# EAGLE design powerblade_4v0 (EAGLE 6.3)

## Sheet 1 of 6: AC-DC Power Supply
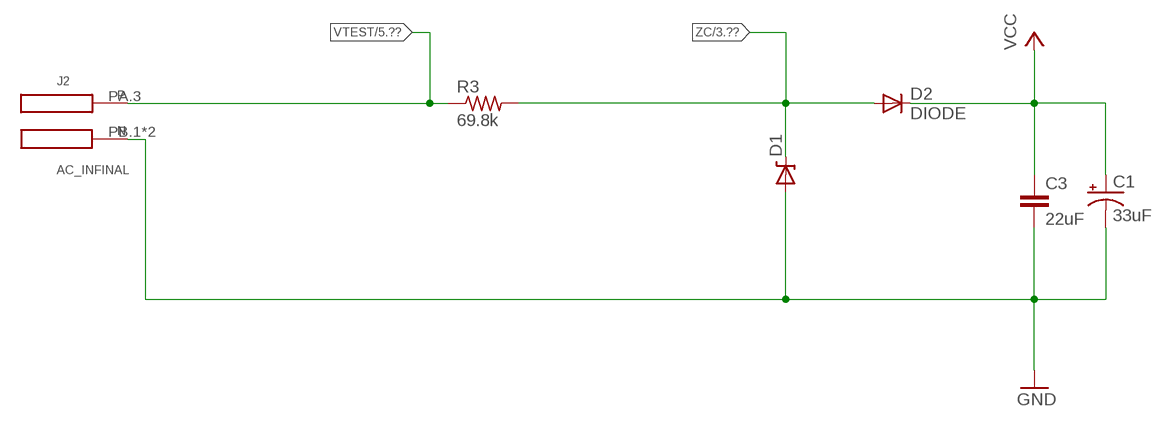
[diagram p0: schematic, sheet 1]

### Parts
C1  33uF  CPOL-US0805_SM  [CPOL0805_SM]
C3  22uF  C-EUC0603_SM  [C0603_SM]
D1  ZENERBZT52  [BZT52]
D2  DIODE  [BAS521]
J2  AC_INFINAL  [AC3_FINAL]
R3  69.8k  R-US_R1210  [R1210]

### Nets
GND: C1.- C3.2 D1.A J2.PB.1(N) J2.PB.3(N) ; also sheet 2,3,4,5,6
VCC: C1.+ C3.1 D2.C ; also sheet 2,3,6
VTEST: J2.PA.3(P) R3.1 ; also sheet 5
ZC: D1.C D2.A R3.2 ; also sheet 3,6

## Sheet 2 of 6: Load Supply Regulation
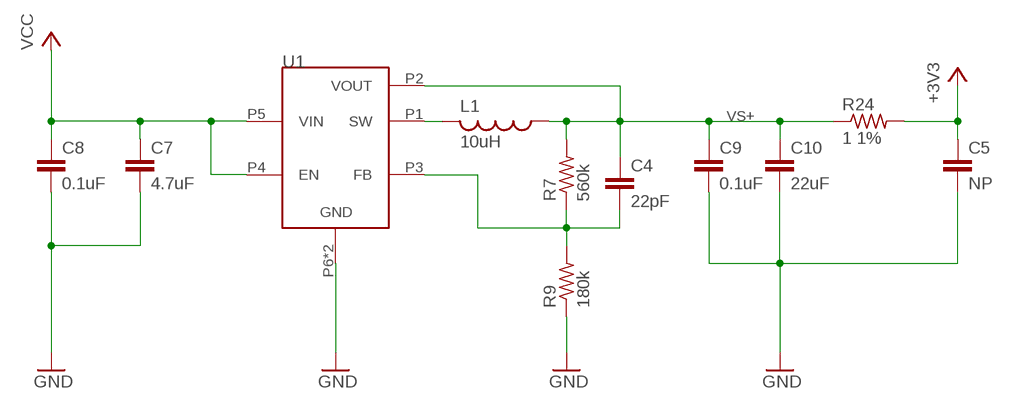
[diagram p1: schematic, sheet 2]

### Parts
C4  22pF  C-EUC0402  [C0402]
C5  NP  C-EUC0603_TN  [C0603_TN]
C7  4.7uF  C-EUC0402  [C0402]
C8  0.1uF  C-EUC0402  [C0402]
C9  0.1uF  C-EUC0402_SM  [C0402_SM]
C10  22uF  C-EUC0603_SM  [C0603_SM]
L1  10uH  L-USL0805  [L0805]
R7  560k  R-US_R0402  [R0402]
R9  180k  R-US_R0402  [R0402]
R24  1 1%  R-US_R0603_SM  [R0603_SM]
U1  TPS62122  [WDFN-6]

### Nets
+3V3: C5.1 R24.2 ; also sheet 3,4,5,6
GND: C5.2 C7.2 C8.2 C9.2 C10.2 R9.1 U1.P6(GND) U1.PAD(GND) ; also sheet 1,3,4,5,6
N$9: L1.2 U1.P1(SW)
N$13: C4.2 R7.1 R9.2 U1.P3(FB)
VCC: C7.1 C8.1 U1.P4(EN) U1.P5(VIN) ; also sheet 1,3,6
VS+: C4.1 C9.1 C10.1 L1.1 R7.2 R24.1 U1.P2(VOUT) ; also sheet 6

## Sheet 3 of 6: MSP430FR5738
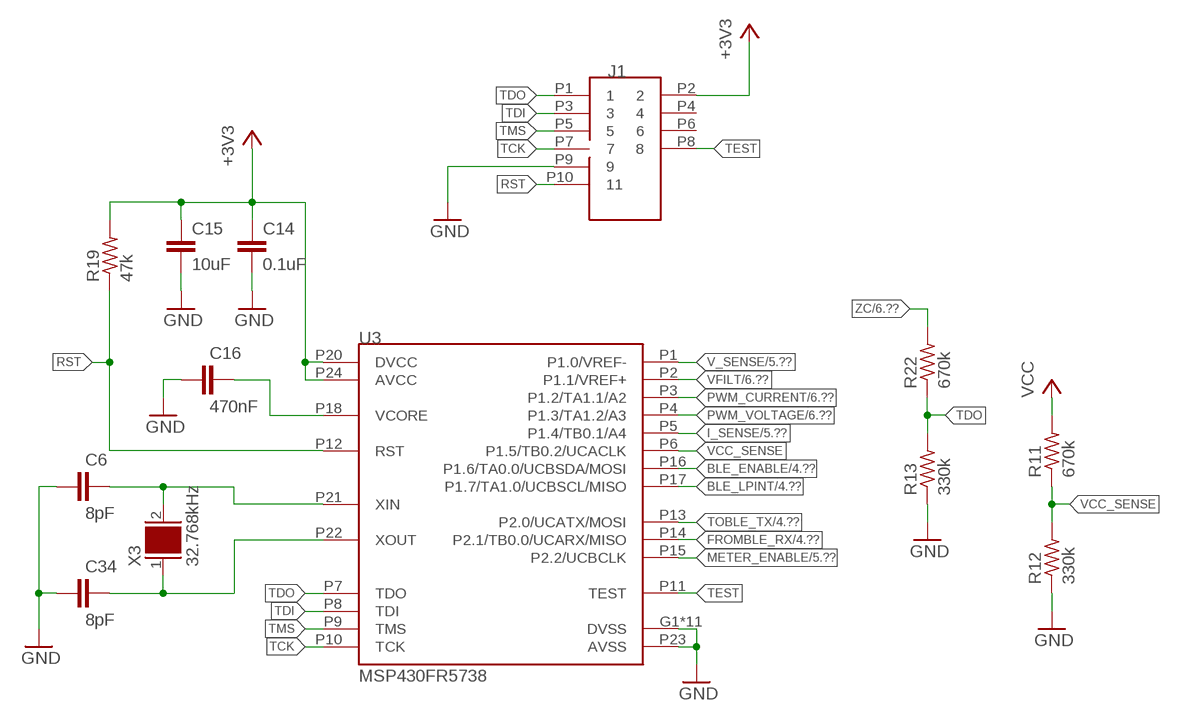
[diagram p2: schematic, sheet 3]

### Parts
C6  8pF  C-EUC0402  [C0402]
C14  0.1uF  C-EUC0402  [C0402]
C15  10uF  C-EUC0603_SM  [C0603_SM]
C16  470nF  C-EUC0402  [C0402]
C34  8pF  C-EUC0402  [C0402]
J1  JTAG_14PIN_IDC-ND  [TC2050-IDC-NL-430-ND]
R11  670k  R-US_R0402  [R0402]
R12  330k  R-US_R0402  [R0402]
R13  330k  R-US_R0402  [R0402]
R19  47k  R-US_R0402  [R0402]
R22  670k  R-US_R0402  [R0402]
U3  MSP430FR5738  [VQFN-24]
X3  32.768kHz  CRYSTAL_0805  [0805]

### Nets
+3V3: C14.1 C15.1 J1.P2 R19.2 U3.P20(DVCC) U3.P24(AVCC) ; also sheet 2,4,5,6
BLE_ENABLE: U3.P16(P1.6/TA0.0/UCBSDA/MOSI) ; also sheet 4
BLE_LPINT: U3.P17(P1.7/TA1.0/UCBSCL/MISO) ; also sheet 4
FROMBLE_RX: U3.P14(P2.1/TB0.0/UCARX/MISO) ; also sheet 4,6
GND: C6.1 C14.2 C15.2 C16.1 C34.1 J1.P9 R12.1 R13.1 U3.G1(DVSS) U3.G2(DVSS) U3.G3(DVSS) U3.G4(DVSS) U3.G5(DVSS) U3.G6(DVSS) U3.G7(DVSS) U3.G8(DVSS) U3.G9(DVSS) U3.P19(DVSS) U3.P23(AVSS) U3.PAD(DVSS) ; also sheet 1,2,4,5,6
I_SENSE: U3.P5(P1.4/TB0.1/A4) ; also sheet 5,6
METER_ENABLE: U3.P15(P2.2/UCBCLK) ; also sheet 5
N$3: C34.2 U3.P22(XOUT) X3.1
N$23: C16.2 U3.P18(VCORE)
N$56: C6.2 U3.P21(XIN) X3.2
PWM_CURRENT: U3.P3(P1.2/TA1.1/A2) ; also sheet 6
PWM_VOLTAGE: U3.P4(P1.3/TA1.2/A3) ; also sheet 6
RST: J1.P10 R19.1 U3.P12(RST)
TCK: J1.P7 U3.P10(TCK)
TDI: J1.P3 U3.P8(TDI)
TDO: J1.P1 R13.2 R22.1 U3.P7(TDO)
TEST: J1.P8 U3.P11(TEST)
TMS: J1.P5 U3.P9(TMS)
TOBLE_TX: U3.P13(P2.0/UCATX/MOSI) ; also sheet 4,6
V_SENSE: U3.P1(P1.0/VREF-) ; also sheet 5,6
VCC: R11.2 ; also sheet 1,2,6
VCC_SENSE: R11.1 R12.2 U3.P6(P1.5/TB0.2/UCACLK)
VFILT: U3.P2(P1.1/VREF+) ; also sheet 5,6
ZC: R22.2 ; also sheet 1,6
Unconnected: J1.P4 J1.P6

## Sheet 4 of 6: nr51822
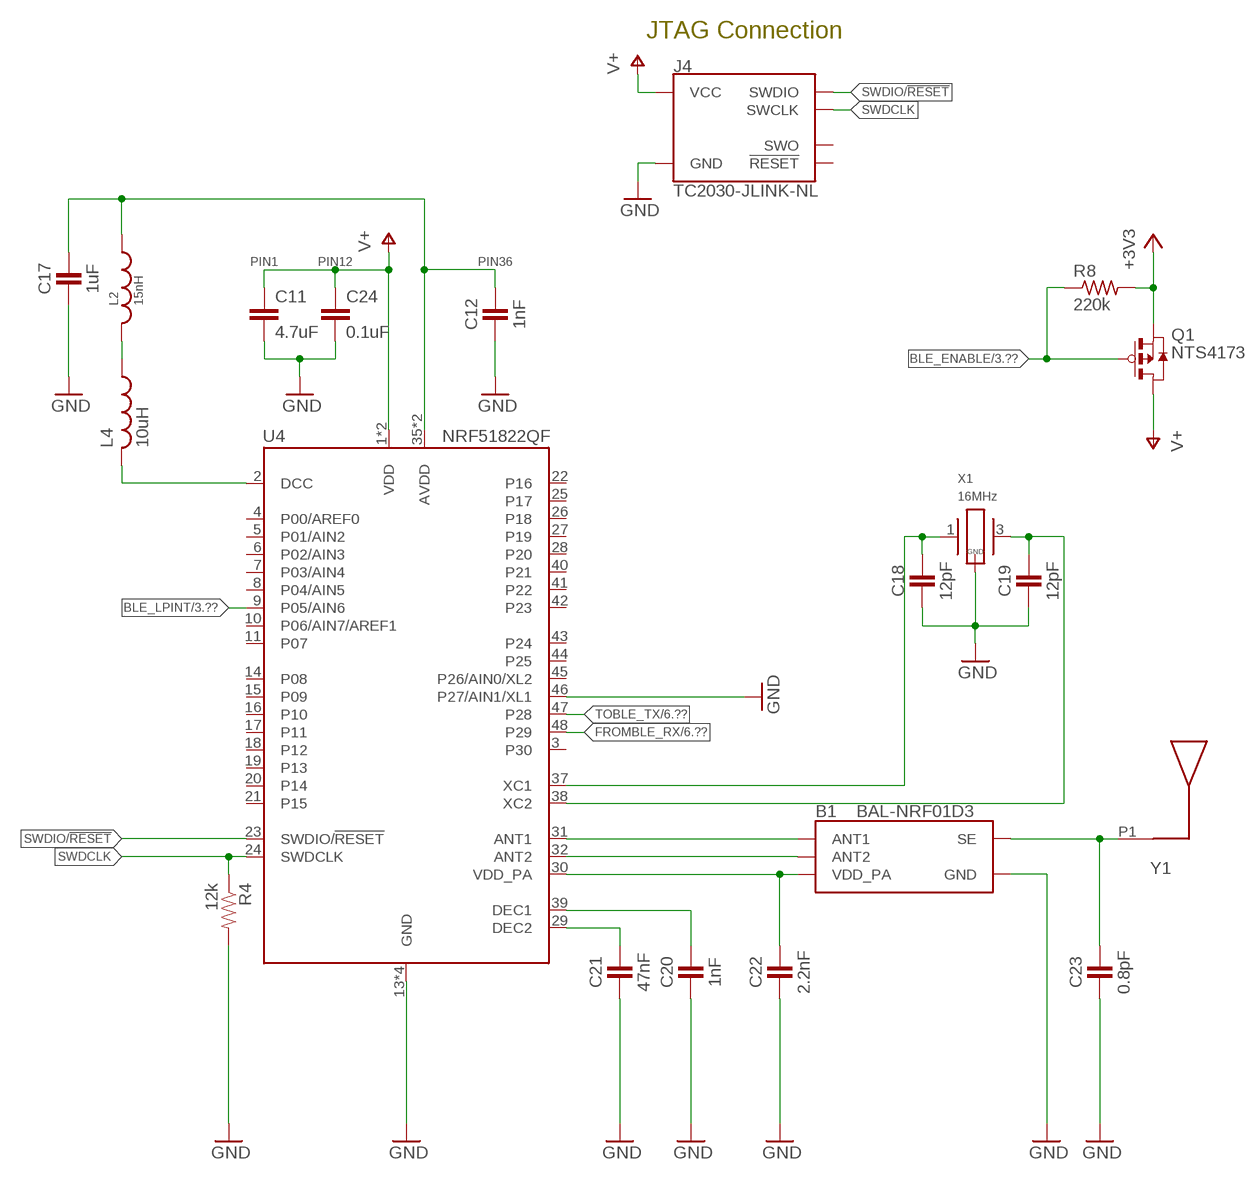
[diagram p3: schematic, sheet 4]

### Parts
B1  BAL-NRF01D3  [BAL-NRF01D3]
C11  4.7uF  C-EUC0402  [C0402]
C12  1nF  CAPACITOR  [0402_CAP]
C17  1uF  CAPACITOR  [0402_CAP]
C18  12pF  CAPACITOR  [0402_CAP]
C19  12pF  CAPACITOR  [0402_CAP]
C20  1nF  CAPACITOR  [0402_CAP]
C21  47nF  CAPACITOR  [0402_CAP]
C22  2.2nF  CAPACITOR  [0402_CAP]
C23  0.8pF  CAPACITOR  [0402_CAP]
C24  0.1uF  C-EUC0402  [C0402]
J4  TC2030-JLINK-NL  [TC2030-IDC-NL]
L2  15nH  INDUCTOR0402  [0402_CAP]
L4  10uH  L-USL0603_TN  [C0603_TN]
Q1  NTS4173  [SC-70-3]
R4  12k  RESISTOR  [0402_RES]
R8  220k  R-US_R0402_SM  [R0402_SM]
U4  NRF51822QF  [QFN-48-6MM]
X1  16MHz  TXC-8Y  [TXC-8Y]
Y1  UREACH_XTEND  [UREACH_XTEND]

### Nets
+3V3: Q1.P2(S) R8.2 ; also sheet 2,3,5,6
AVDD: C12.1 C17.1 L2.1 U4.35(AVDD) U4.36(AVDD)
BLE_ENABLE: Q1.P1(G) R8.1 ; also sheet 3
BLE_LPINT: U4.9(P05/AIN6) ; also sheet 3
DCC: L4.2 U4.2(DCC)
FROMBLE_RX: U4.48(P29) ; also sheet 3,6
GND: B1.GND C11.2 C12.2 C17.2 C18.2 C19.2 C20.2 C21.2 C22.2 C23.2 C24.2 J4.5(GND) R4.2 U4.13(GND) U4.33(GND) U4.34(GND) U4.46(P27/AIN1/XL1) U4.GND X1.2(GND) X1.4(GND) ; also sheet 1,2,3,5,6
N$4: B1.SE C23.1 Y1.P1
N$5: B1.ANT1 U4.31(ANT1)
N$6: B1.ANT2 U4.32(ANT2)
N$10: L2.2 L4.1
N$16: C18.1 U4.37(XC1) X1.1
N$17: C19.1 U4.38(XC2) X1.3
N$18: C20.1 U4.39(DEC1)
N$19: C21.1 U4.29(DEC2)
SWDCLK: J4.4(SWCLK) R4.1 U4.24(SWDCLK)
SWDIO/!RESET: J4.2(SWDIO) U4.23(SWDIO/!RESET)
TOBLE_TX: U4.47(P28) ; also sheet 3,6
V+: C11.1 C24.1 J4.1(VCC) Q1.P3(D) U4.1(VDD) U4.12(VDD)
VDD_PA: B1.VCC(VDD_PA) C22.1 U4.30(VDD_PA)
Unconnected: J4.3(!RESET) J4.6(SWO) U4.3(P30) U4.4(P00/AREF0) U4.5(P01/AIN2) U4.6(P02/AIN3) U4.7(P03/AIN4) U4.8(P04/AIN5) U4.10(P06/AIN7/AREF1) U4.11(P07) U4.14(P08) U4.15(P09) U4.16(P10) U4.17(P11) U4.18(P12) U4.19(P13) U4.20(P14) U4.21(P15) U4.22(P16) U4.25(P17) U4.26(P18) U4.27(P19) U4.28(P20) U4.40(P21) U4.41(P22) U4.42(P23) U4.43(P24) U4.44(P25) U4.45(P26/AIN0/XL2)

### Notes on the sheet
- JTAG Connection
- PIN1 | PIN12 | PIN36

## Sheet 5 of 6: Power Sensing!
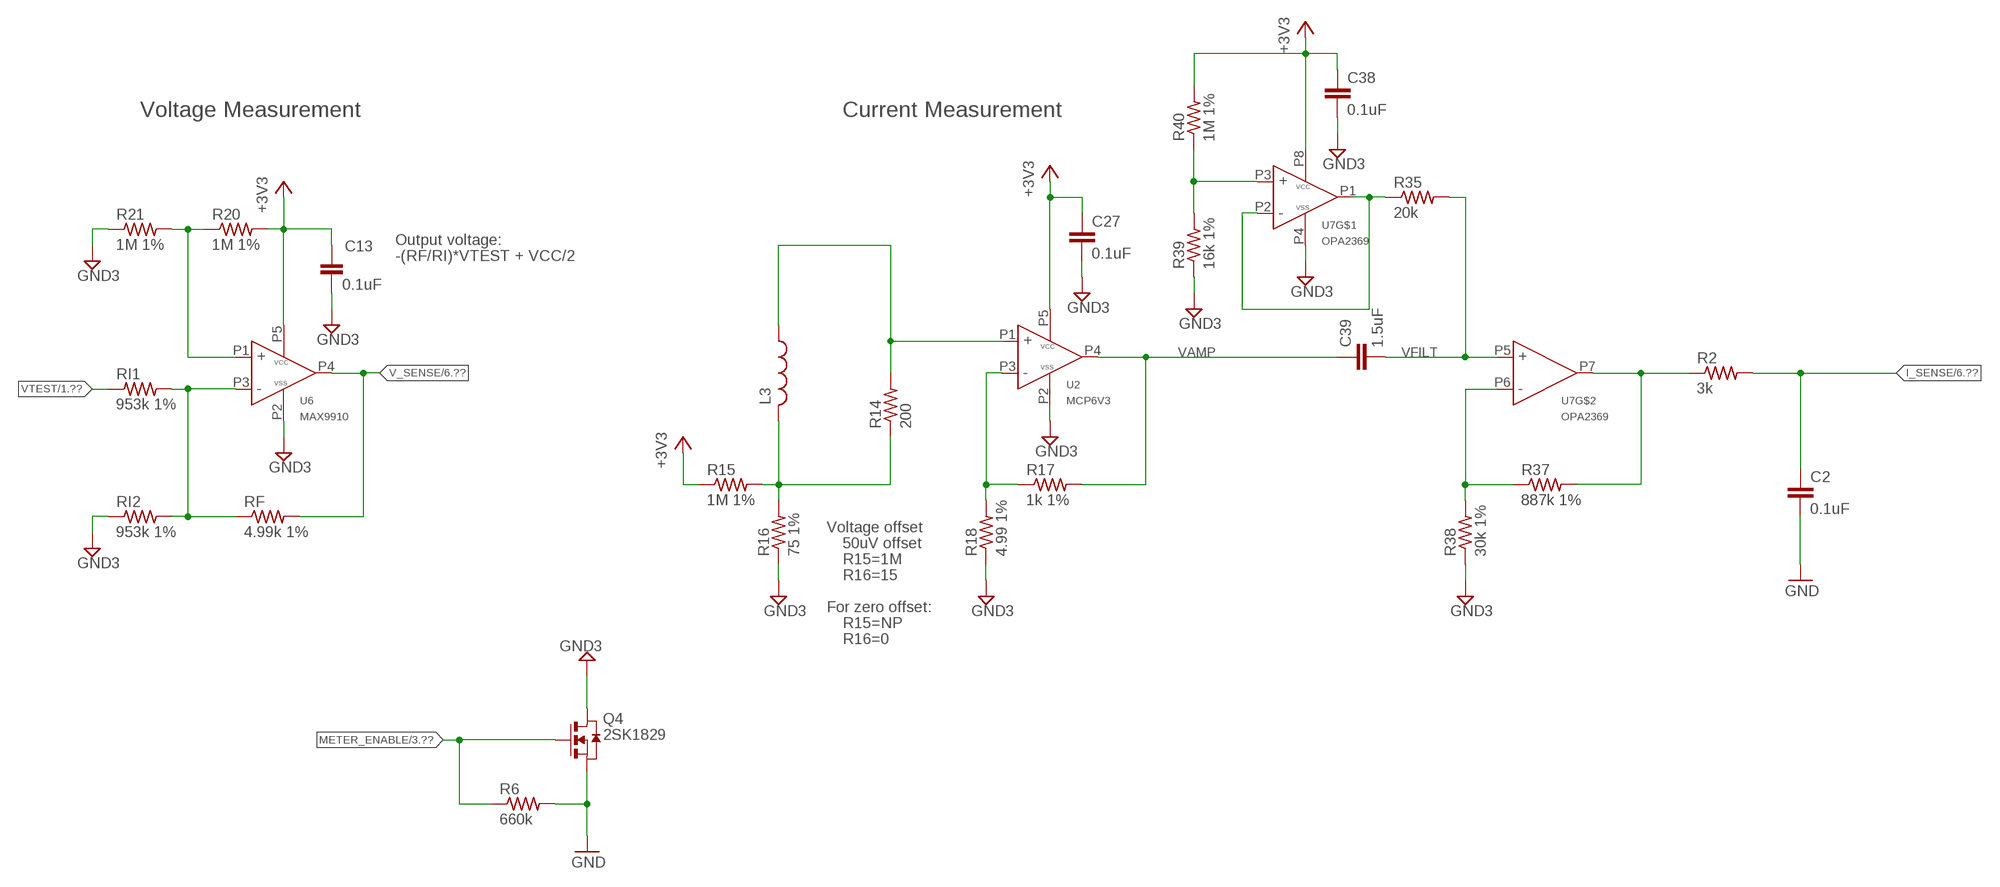
[diagram p4: schematic, sheet 5]

### Parts
C2  0.1uF  C-EUC0402  [C0402]
C13  0.1uF  CAPACITOR  [0402_CAP]
C27  0.1uF  C-EUC0402  [C0402]
C38  0.1uF  C-EUC0402  [C0402]
C39  1.5uF  C-EUC0402  [C0402]
L3  L-USL0805  [L0805]
Q4  2SK1829  [SC-70-3]
R2  3k  R-US_R0402_SM  [R0402_SM]
R6  660k  R-US_R0402  [R0402]
R14  200  R-US_R0402  [R0402]
R15  1M 1%  R-US_R0402  [R0402]
R16  75 1%  R-US_R0402  [R0402]
R17  1k 1%  R-US_R0402  [R0402]
R18  4.99 1%  R-US_R0402  [R0402]
R20  1M 1%  R-US_R0402  [R0402]
R21  1M 1%  R-US_R0402_SM  [R0402_SM]
R35  20k  R-US_R0402  [R0402]
R37  887k 1%  R-US_R0402  [R0402]
R38  30k 1%  R-US_R0402  [R0402]
R39  16k 1%  R-US_R0402  [R0402]
R40  1M 1%  R-US_R0402  [R0402]
RF  4.99k 1%  R-US_R0402  [R0402]
RI1  953k 1%  R-US_R0402  [R0402]
RI2  953k 1%  R-US_R0402  [R0402]
U2  MCP6V3  [SC70-5]
U6  MAX9910  [SC70-5]
U7  OPA2369  [SOT-23-8]

### Nets
+3V3: C13.1 C27.1 C38.1 R15.1 R20.2 R40.2 U2.P5(VCC) U6.P5(VCC) U7.P8(VCC) ; also sheet 2,3,4,6
GND: C2.2 Q4.P2(S) R6.2 ; also sheet 1,2,3,4,6
GND3: C13.2 C27.2 C38.2 Q4.P3(D) R16.1 R18.1 R21.1 R38.1 R39.1 RI2.1 U2.P2(VSS) U6.P2(VSS) U7.P4(VSS)
I_SENSE: C2.1 R2.2 ; also sheet 3,6
METER_ENABLE: Q4.P1(G) R6.1 ; also sheet 3
N$1: R2.1 R37.2 U7.P7(OUT)
N$37: L3.2 R14.1 R15.2 R16.2
N$38: L3.1 R14.2 U2.P1(IN+)
N$40: R20.1 R21.2 U6.P1(IN+)
N$41: RF.1 RI1.2 RI2.2 U6.P3(IN-)
N$65: R17.1 R18.2 U2.P3(IN-)
N$66: R37.1 R38.2 U7.P6(IN-)
N$68: R35.1 U7.P1(OUT) U7.P2(IN-)
N$70: R39.2 R40.1 U7.P3(IN+)
V_SENSE: RF.2 U6.P4(OUT) ; also sheet 3,6
VAMP: C39.1 R17.2 U2.P4(OUT)
VFILT: C39.2 R35.2 U7.P5(IN+) ; also sheet 3,6
VTEST: RI1.1 ; also sheet 1

### Notes on the sheet
- Voltage Measurement | Current Measurement
- Output voltage:
- -(RF/RI)*VTEST + VCC/2
- Voltage offset
- 50uV offset
- R15=1M
- R16=15
- For zero offset:
- R15=NP
- R16=0

## Sheet 6 of 6: Debugging Connector. OOF
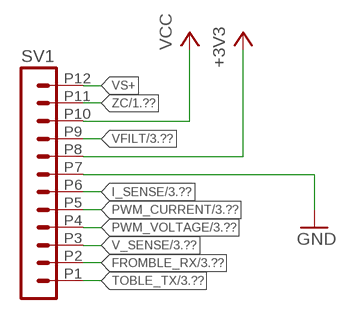
[diagram p5: schematic, sheet 6]

### Parts
SV1  MA12-11M27  [MA12-1_1MM27]

### Nets
+3V3: SV1.P8 ; also sheet 2,3,4,5
FROMBLE_RX: SV1.P2 ; also sheet 3,4
GND: SV1.P7 ; also sheet 1,2,3,4,5
I_SENSE: SV1.P6 ; also sheet 3,5
PWM_CURRENT: SV1.P5 ; also sheet 3
PWM_VOLTAGE: SV1.P4 ; also sheet 3
TOBLE_TX: SV1.P1 ; also sheet 3,4
V_SENSE: SV1.P3 ; also sheet 3,5
VCC: SV1.P10 ; also sheet 1,2,3
VFILT: SV1.P9 ; also sheet 3,5
VS+: SV1.P12 ; also sheet 2
ZC: SV1.P11 ; also sheet 1,3

## Library data of the parts
B1 = chips:BAL-NRF01D3: 50 ohm nominal input / conjugate match balun to nRF51422-QFAA, nRF24LE1, nRF51822-QFAA/AB, with integrated harmonic filter; DIGIKEY: 497-13637-1-ND; MOUSER: 511-BAL-NRF01D3
C1 = rcl:CPOL-US: POLARIZED CAPACITOR, American symbol; DIGIKEY: 478-8650-1-ND
C2 = rcl:C-EU: CAPACITOR, European symbol; DIGIKEY: 490-10777-1-ND
C3 C10 = rcl:C-EU: CAPACITOR, European symbol; DIGIKEY: 445-9077-1-ND
C4 = rcl:C-EU: CAPACITOR, European symbol; DIGIKEY: 445-1239-1-ND
C5 = rcl:C-EU: CAPACITOR, European symbol; DIGIKEY: NP
C6 C34 = rcl:C-EU: CAPACITOR, European symbol; DIGIKEY: 445-4890-1-ND
C7 = rcl:C-EU: CAPACITOR, European symbol; DIGIKEY: 445-8023-1-ND
C8 C9 C14 C24 C27 C38 = rcl:C-EU: CAPACITOR, European symbol; DIGIKEY: 445-4952-1-ND
C11 = rcl:C-EU: CAPACITOR, European symbol; DIGIKEY: 445-5947-1-ND
C12 C20 = passives:CAPACITOR: 0402 Capacitor; DIGIKEY: 490-1303-1-ND
C13 = passives:CAPACITOR: 0402 Capacitor; DIGIKEY: 445-4952-1-ND
C15 = rcl:C-EU: CAPACITOR, European symbol; DIGIKEY: 445-6853-1-ND
C16 = rcl:C-EU: CAPACITOR, European symbol; DIGIKEY: 445-4989-1-ND
C17 = passives:CAPACITOR: 0402 Capacitor; DIGIKEY: 1276-1513-1-ND
C18 C19 = passives:CAPACITOR: 0402 Capacitor; DIGIKEY: 490-6197-1-ND
C21 = passives:CAPACITOR: 0402 Capacitor; DIGIKEY: 445-1264-1-ND
C22 = passives:CAPACITOR: 0402 Capacitor; DIGIKEY: 490-5419-1-ND
C23 = passives:CAPACITOR: 0402 Capacitor; DIGIKEY: 490-6269-1-ND
C39 = rcl:C-EU: CAPACITOR, European symbol; DIGIKEY: 445-13815-1-ND
D1 = powerfilm:ZENER; DIGIKEY: BZT52C10T-7DICT-ND
D2 = powerfilm:DIODE; DIGIKEY: BAS521-7DICT-ND
J1 = ibat:JTAG_14PIN; DIGIKEY: NP
J2 = powerfilm:AC_IN; DIGIKEY: ED1649-ND; DIGIKEY_2: ED1649-ND; DIGIKEY_3: ED1649-ND; DIGIKEY_4: ED1649-ND
J4 = connector:TC2030-JLINK; DIGIKEY: NP
L1 = rcl:L-US: INDUCTOR, American symbol; DIGIKEY: 490-4990-1-ND
L2 = passives:INDUCTOR; DIGIKEY: 587-1521-1-ND
L3 = rcl:L-US: INDUCTOR, American symbol; DIGIKEY: 732-3452-1-ND
L4 = rcl:L-US: INDUCTOR, American symbol; DIGIKEY: 490-4025-1-ND
Q1 = powerfilm:NTS4173; DIGIKEY: NTS4173PT1GOSCT-ND
Q4 = powerfilm:2SK1829; DIGIKEY: 2SK1829TE85LFCT-ND
R2 = rcl:R-US_: RESISTOR, American symbol; DIGIKEY: P3.00KLCT-ND
R3 = rcl:R-US_: RESISTOR, American symbol; DIGIKEY: P69.8KAACT-ND
R4 = passives:RESISTOR: Resistor Basic schematic elements and footprints for 0603, 1206, and PTH resistors.; DIGIKEY: RHM12.0KCDCT-ND
R6 R11 R22 = rcl:R-US_: RESISTOR, American symbol; DIGIKEY: P665KLCT-ND
R7 = rcl:R-US_: RESISTOR, American symbol; DIGIKEY: P560KLCT-ND
R8 = rcl:R-US_: RESISTOR, American symbol; DIGIKEY: P220KJCT-ND
R9 = rcl:R-US_: RESISTOR, American symbol; DIGIKEY: P180KLCT-ND
R12 R13 = rcl:R-US_: RESISTOR, American symbol; DIGIKEY: P330KLCT-ND
R14 = rcl:R-US_: RESISTOR, American symbol; DIGIKEY: P200LCT-ND
R15 R20 R21 R40 = rcl:R-US_: RESISTOR, American symbol; DIGIKEY: P1.00MLCT-ND
R16 = rcl:R-US_: RESISTOR, American symbol; DIGIKEY: P75.0LCT-ND
R17 = rcl:R-US_: RESISTOR, American symbol; DIGIKEY: P1.00KLCT-ND
R18 = rcl:R-US_: RESISTOR, American symbol; DIGIKEY: RMCF0402FT4R99CT-ND
R19 = rcl:R-US_: RESISTOR, American symbol; DIGIKEY: P47KJCT-ND
R24 = rcl:R-US_: RESISTOR, American symbol; DIGIKEY: P1.0AJCT-ND
R35 = rcl:R-US_: RESISTOR, American symbol; DIGIKEY: P20.0KLCT-ND
R37 = rcl:R-US_: RESISTOR, American symbol; DIGIKEY: P887KLCT-ND
R38 = rcl:R-US_: RESISTOR, American symbol; DIGIKEY: P30.0KLCT-ND
R39 = rcl:R-US_: RESISTOR, American symbol; DIGIKEY: P16.0KLCT-ND
RF = rcl:R-US_: RESISTOR, American symbol; DIGIKEY: P4.99KLCT-ND
RI1 RI2 = rcl:R-US_: RESISTOR, American symbol; DIGIKEY: P953KLCT-ND
SV1 = con-lstb:MA12-1: PIN HEADER; DIGIKEY: S9014E-12-ND
U1 = powerfilm:TPS62122; DIGIKEY: 296-27695-1-ND
U2 = powerfilm:MCP6V3; DIGIKEY: 296-19547-1-ND
U3 = powerfilm:MSP430FR5738; DIGIKEY: 296-29232-1-ND
U4 = chips:NRF51822: Multiprotocol Bluetooth® 4.0 low energy/2.4 GHz RF SoC; DIGIKEY: 1490-1032-1-ND; MOUSER: 949-NRF51822-QFAB-R7
U6 = powerfilm:MAX9910; DIGIKEY: 296-25252-1-ND
U7 = powerfilm:OPA2369; DIGIKEY: 296-22671-1-ND
X1 = crystals:TXC-8Y: 2mmx1.6mm SMD Crystal; DIGIKEY: 887-2003-1-ND
X3 = general:CRYSTAL_0805; DIGIKEY: 535-12373-1-ND
Y1 = powerfilm:UREACH_XTEND; FRACTUS: FR05-S1-N-0-110

## Board
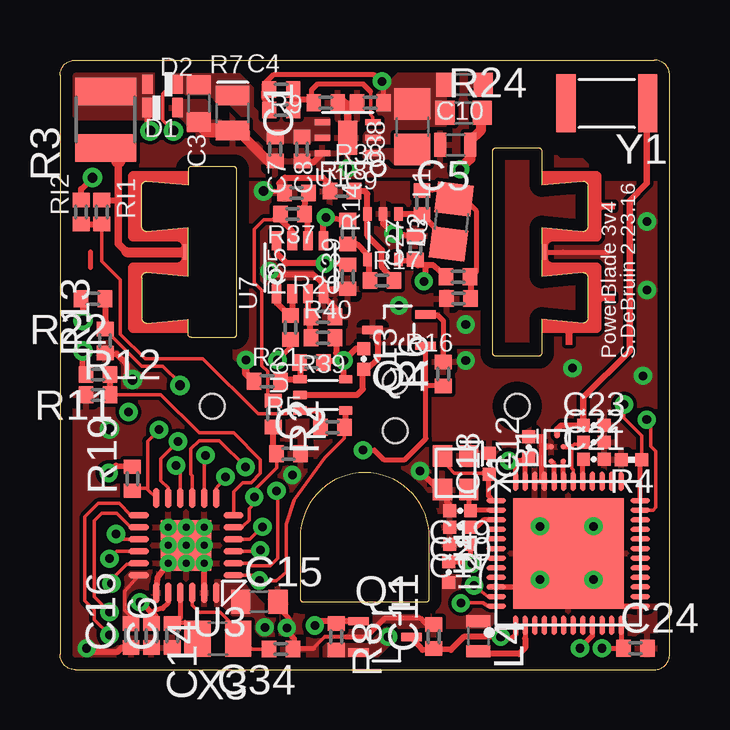
[diagram p6: board, top side]
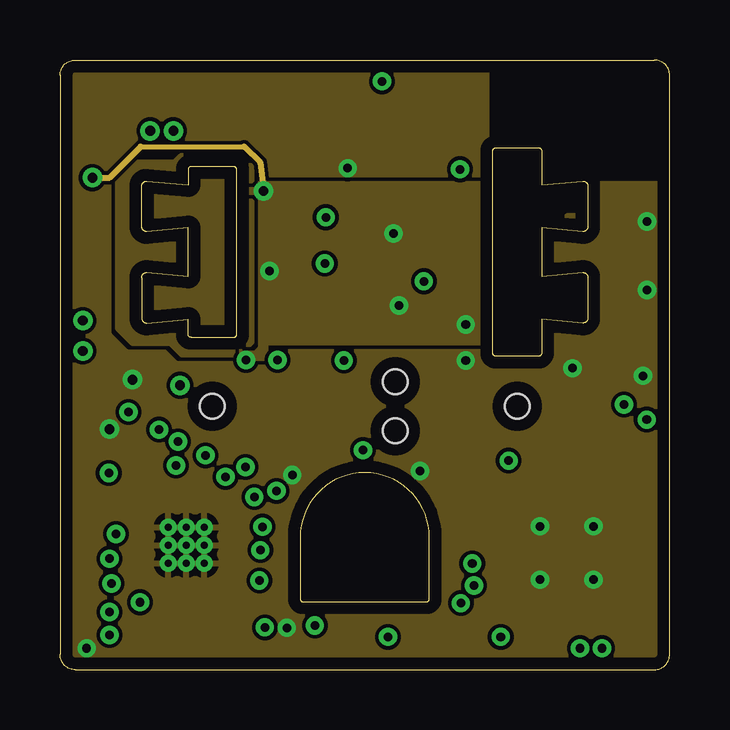
[diagram p7: board, inner layer Route2]
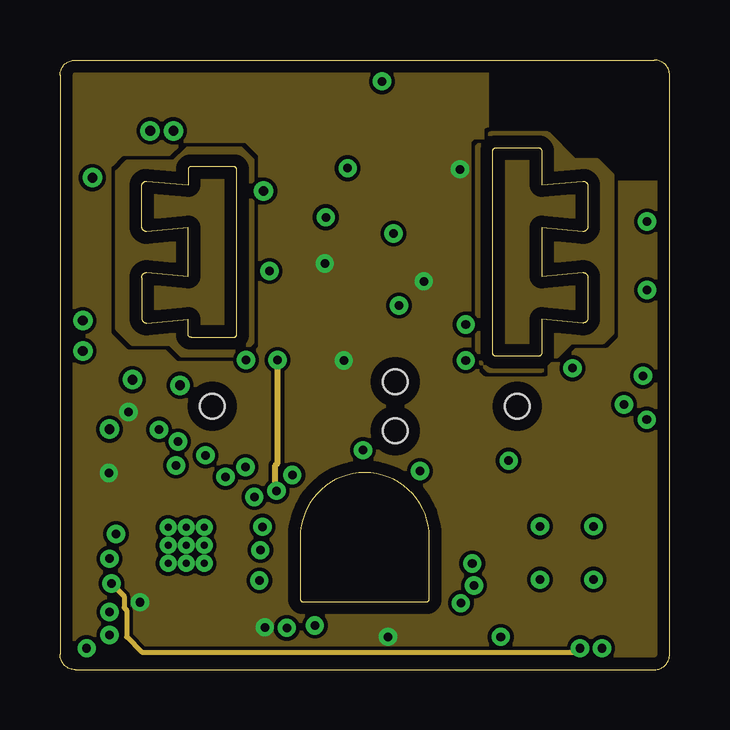
[diagram p8: board, inner layer Route15]
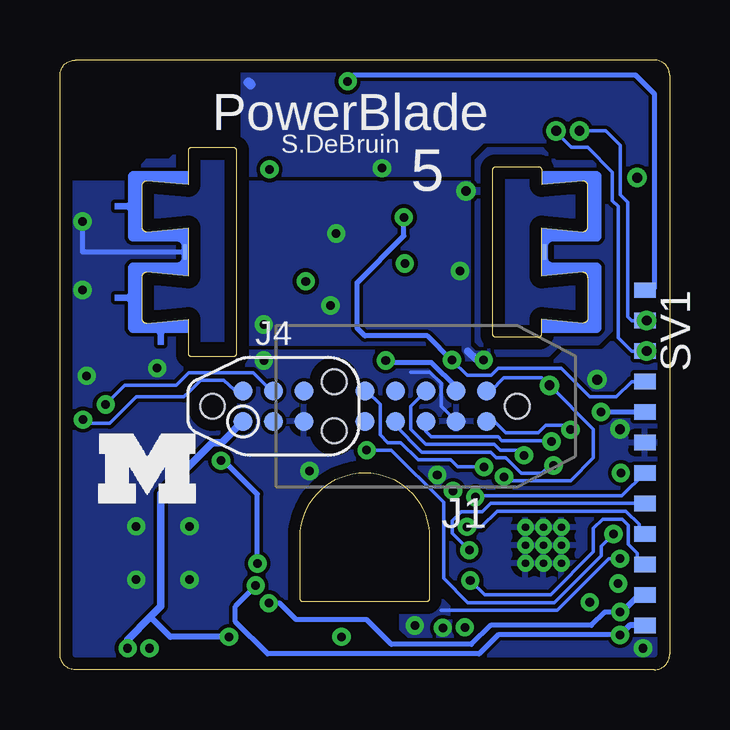
[diagram p9: board, bottom side, seen from below]

Size 25.4 x 25.4 mm. Coordinates in mm from the lower left corner, seen from the top.
Copper layers (1+2*15+16): Top 0.0178mm / dielectric 12mil / Route2 0.0356mm / dielectric 28mil / Route15 0.0356mm / dielectric 12mil / Bottom 0.0178mm
Design rules "SSC-EAGLE-4Lyr_v1.0.0.3 *": minimum track width 6mil, minimum drill 8mil, track to track 6mil, track to pad 6mil, pad to pad 6mil, via to via 6mil, smd to smd 6mil, copper to edge 20mil, drill to drill 16mil, minimum pad ring 8mil, minimum via ring 8mil, stop-mask expansion 3mil, vias tented up to drill 0mil, thermal gap 10mil

### Footprints (pad centres in the part's own frame; a part is rotated, then mirrored left to right if it is on the bottom)
BAL-NRF01D3 = smd 0.22 x 0.22: ANT1 -0.537,-0.25; ANT2 -0.537,0.25; GND 0.069,0.25; SE 0.537,0; VCC 0.069,-0.25
CPOL0805_SM = smd 0.8 x 1.4: + -0.73,0; - 0.73,0
C0402 = smd 0.6 x 0.7: 1 -0.5,0; 2 0.5,0
C0603_SM = smd 0.8 x 1: 1 -0.775,0; 2 0.775,0
C0603_TN = smd 0.5 x 1: 1 -0.625,0; 2 0.625,0
C0402_SM = smd 0.6 x 0.7: 1 -0.55,0; 2 0.55,0
0402_CAP = smd 0.536 x 0.546: 1 -0.433,0; 2 0.433,0
BZT52 = smd 0.45 x 0.8: A -0.625,0; C 0.625,0
BAS521 = smd 0.45 x 0.8: A -0.625,0; C 0.625,0
TC2050-IDC-NL-430-ND = smd 0.787 x 0.787: P1 -2.54,-0.635; P2 -1.27,-0.635; P3 0,-0.635; P4 1.27,-0.635; P5 2.54,-0.635; P6 2.54,0.635; P7 1.27,0.635; P8 0,0.635; P9 -1.27,0.635; P10 -2.54,0.635 | hole 1.029: -3.81,0
AC3_FINAL = smd 0.152 x 0.635 bottom: PA.1 -7.493,0; PB.1 7.493,0 | smd 0.152 x 0.635: PA.3 -7.493,0; PB.3 7.493,0
TC2030-IDC-NL = smd 0.787 x 0.787: 1 -1.27,-0.635; 2 -1.27,0.635; 3 0,-0.635; 4 0,0.635; 5 1.27,-0.635; 6 1.27,0.635 | hole 1.016: -2.54,0; 2.54,1.016; 2.54,-1.016
L0805 = smd 1.3 x 1.5: 1 -0.95,0; 2 0.95,0
SC-70-3 = smd 0.85 x 0.35: P1 -1.1,0.65; P2 -1.1,-0.65; P3 1.1,0
R0402_SM = smd 0.6 x 0.7: 1 -0.55,0; 2 0.55,0
R1210 = smd 1.15 x 2.55: 1 -1.175,0; 2 1.175,0
0402_RES = smd 0.536 x 0.546: 1 -0.433,0; 2 0.433,0
R0402 = smd 0.6 x 0.7: 1 -0.5,0; 2 0.5,0
R0603_SM = smd 0.8 x 1: 1 -0.775,0; 2 0.775,0
MA12-1_1MM27 = smd 0.889 x 0.635: P1 0,6.985; P2 0,5.715; P3 0,4.445; P4 0,3.175; P5 0,1.905; P6 0,0.635; P7 0,-0.635; P8 0,-1.905; P9 0,-3.175; P10 0,-4.445; P11 0,-5.715; P12 0,-6.985
WDFN-6 = smd 0.65 x 0.25: P1 -1.05,0.65; P2 -1.05,0; P3 -1.05,-0.65; P4 1.05,-0.65; P5 1.05,0; P6 1.05,0.65 | smd 0.8 x 1.4: PAD 0,0
SC70-5 = smd 0.55 x 0.35: P1 -0.95,0.65; P2 -0.95,0; P3 -0.95,-0.65; P4 0.95,-0.65; P5 0.95,0.65
VQFN-24 = drill 0.3 pad 0.5: G1 -0.75,0.75; G2 0,0.75; G3 0.75,0.75; G4 -0.75,0; G5 0,0; G6 0.75,0; G7 -0.75,-0.75; G8 0,-0.75; G9 0.75,-0.75 | smd 0.85 x 0.28: P1 -1.975,1.25; P2 -1.975,0.75; P3 -1.975,0.25; P4 -1.975,-0.25; P5 -1.975,-0.75; P6 -1.975,-1.25; P13 1.975,-1.25; P14 1.975,-0.75; P15 1.975,-0.25; P16 1.975,0.25; P17 1.975,0.75; P18 1.975,1.25 | smd 0.28 x 0.85: P7 -1.25,-1.975; P8 -0.75,-1.975; P9 -0.25,-1.975; P10 0.25,-1.975; P11 0.75,-1.975; P12 1.25,-1.975; P19 1.25,1.975; P20 0.75,1.975; P21 0.25,1.975; P22 -0.25,1.975; P23 -0.75,1.975; P24 -1.25,1.975 | smd 2.1 x 2.1: PAD 0,0
QFN-48-6MM = smd 0.8 x 0.203: 1 -3,2.2; 2 -3,1.8; 3 -3,1.4; 4 -3,1; 5 -3,0.6; 6 -3,0.2; 7 -3,-0.2; 8 -3,-0.6; 9 -3,-1; 10 -3,-1.4; 11 -3,-1.8; 12 -3,-2.2; 25 3,-2.2; 26 3,-1.8; 27 3,-1.4; 28 3,-1; 29 3,-0.6; 30 3,-0.2; 31 3,0.2; 32 3,0.6; 33 3,1; 34 3,1.4; 35 3,1.8; 36 3,2.2 | smd 0.203 x 0.8: 13 -2.2,-3; 14 -1.8,-3; 15 -1.4,-3; 16 -1,-3; 17 -0.6,-3; 18 -0.2,-3; 19 0.2,-3; 20 0.6,-3; 21 1,-3; 22 1.4,-3; 23 1.8,-3; 24 2.2,-3; 37 2.2,3; 38 1.8,3; 39 1.4,3; 40 1,3; 41 0.6,3; 42 0.2,3; 43 -0.2,3; 44 -0.6,3; 45 -1,3; 46 -1.4,3; 47 -1.8,3; 48 -2.2,3 | smd 4.6 x 4.6: GND 0,0
SOT-23-8 = smd 0.8 x 0.4: P1 -1.1,0.975; P2 -1.1,0.325; P3 -1.1,-0.325; P4 -1.1,-0.975; P5 1.1,-0.975; P6 1.1,-0.325; P7 1.1,0.325; P8 1.1,0.975
TXC-8Y = smd 0.9 x 0.8: 1 -0.7,-0.55; 2 0.7,-0.55; 3 0.7,0.55; 4 -0.7,0.55
0805 = smd 1.1 x 1.5: 1 -0.85,0; 2 0.85,0
UREACH_XTEND = smd 0.8 x 2.4: NC 1.7,0; P1 -1.7,0

### Placement (x,y rotation side)
B1  20.72,9.22 90 top
C1  7.19,23.19 270 top
C2  9.52,8.99 0 top
C3  5.79,23.59 270 top
C4  9.22,23.32 0 top
C5  16.48,21.86 180 top
C6  4.67,1.41 90 top
C7  8.97,21.69 270 top
C8  10.08,21.69 270 top
C9  12.93,23.62 180 top
C10  16.86,24.37 0 top
C11  15.57,1.37 90 top
C12  19.53,9.27 90 top
C13  12.65,12.94 270 top
C14  3.81,1.41 270 top
C15  8.31,2.82 0 top
C16  2.96,1.42 90 top
C17  16.67,5.23 180 top
C18  17.88,8.58 90 top
C19  16.67,6.62 180 top
C20  16.67,5.92 180 top
C21  22.24,8.76 0 top
C22  22.24,9.47 0 top
C23  22.24,10.18 0 top
C24  23.98,0.89 0 top
C27  14.81,17.58 90 top
C34  9.2,0.86 180 top
C38  11.99,16.37 270 top
C39  11.99,18.24 90 top
D1  4.27,23.42 180 top
D2  4.27,24.38 0 top
J1  10.16,10.97 180 bottom
J2  12.7,17.4 0 top
J4  16.51,10.97 0 bottom
L1  14.68,22.62 270 top
L2  16.19,4.06 270 top
L3  16.31,18.67 82.9 top
L4  17.43,1.4 270 top
Q1  13.54,1.37 0 top
Q4  14.13,14.14 180 top
R2  8.89,10.65 270 top
R3  1.9,22.91 90 top
R4  23.81,8.75 180 top
R6  15.97,12.32 90 top
R7  9.22,24.17 180 top
R8  11.51,1.37 270 top
R9  11.07,23.62 180 top
R11  1.59,12.3 180 top
R12  1.59,11.45 0 top
R13  1.88,13.7 90 top
R14  15.08,19.46 270 top
R15  16.59,16.37 0 top
R16  16.61,15.46 0 top
R17  13.41,16.21 180 top
R18  11.75,19.94 0 top
R19  3.02,7.95 90 top
R20  10.48,12.8 0 top
R21  8.64,12.01 0 top
R22  1.38,15.46 180 top
R24  16.81,23.19 0 top
R35  9.6,14.25 270 top
R37  9.68,18.99 180 top
R38  9.86,19.86 0 top
R39  10.95,14.7 180 top
R40  10.95,13.83 0 top
RF  11.35,10.1 0 top
RI1  1.74,19.07 270 top
RI2  0.88,19.07 270 top
SV1  1.03,8.83 180 bottom
U1  11.99,22.16 180 top
U2  13.46,18.03 270 top
U3  5.25,5.18 180 top
U4  21.18,4.84 90 top
U6  10.95,11.45 0 top
U7  10,16.76 90 top
U$1  [BLOCK-M]  23.81,6.92 0 bottom
X1  16.48,8.2 270 top
X3  6.58,1.28 180 top
Y1  22.78,23.6 180 top

### Tracks (layer width: path | path; a pad name or v marks a point on that pad's centre or on a via)
+3V3  (via drill 0.36)
  Top 0.203: U3.P20 4.5,2.77 4.29,2.56 3.97,2.48 3.85,2.36
  Top 0.254: R15.1 15.56,16.84 15.16,16.84 | U2.P5 14.17,17.03 C27.1 14.81,16.96 14.92,16.84 15.16,16.84 | v15.16,16.18 15.24,16.26 15.24,16.76 15.16,16.84 | C38.1 11.98,16.92 v11.03,16.92 9.45,16.92 9.05,17.32 9.05,17.84 U7.P8 | C14.1 3.97,2.24 3.85,2.36 3.48,2.73 v3.33,2.81 | R40.2 11.51,13.82 11.51,13.2 v11.83,12.88 | v2.03,8.19 2.34,8.5 R19.2 | R20.2 11.06,12.88 v11.83,12.88 | v11.83,12.88 12.32,13.37 C13.1 | U6.P5 11.83,12.17 v11.83,12.88
  Top 0.406: v16.67,20.85 17.1,21.28 C5.1 17.1,22.04 17.54,22.48 17.54,23.15 R24.2
  Bottom 0.203: SV1.P8 v2.86,10.73 | J1.P2 8.89,11.76 9.92,12.8 11.74,12.8 v11.83,12.88
  other vias: 8.53,1.76 13.67,1.37
  pour Route15 (rank 2): -0.32,-0.38 24.89,-0.38 24.89,20.26 17.78,20.26 17.78,26.29 -0.32,26.29
  pour Top (no thermals): 6.51,2.32 7.54,2.32 8.49,1.37 8.97,1.37 9.13,1.52 9.13,1.92 7.54,3.67 6.51,3.67
  pour Top (no thermals): 11.03,0.57 13.18,0.57 13.65,1.05 13.65,1.6 13.41,1.84 12.46,1.84 11.67,1.05 11.03,1.05
AVDD  (via drill 0.36)
  Top 0.203: U4.35 19.38,8.7 19.44,8.75 | 19.44,8.75 C12.1 | 19.44,8.75 19.37,8.83 19.25,8.71 19.05,8.71 | L2.1 17.1,4.5 v17.18,4.42 17.1,4.5 C17.1 | 19.05,8.71 v18.69,8.71 | U4.36 18.98,8.64 19.05,8.71
  Bottom 0.203: v17.18,4.42 17.18,7.31 18.57,8.71 v18.69,8.71
BLE_ENABLE  (via drill 0.36)
  Top 0.152: U3.P16 2.37,4.93 v2.06,4.62
  Top 0.254: Q1.P1 11.45,2.02 | 11.45,2.02 R8.1 | 11.45,2.02 10.79,2.02 v10.62,1.84
  Bottom 0.152: 9.52,2.48 4.68,2.48 2.54,4.62 v2.06,4.62
  pour Bottom (no thermals): 9.21,2.64 9.21,1.6 9.45,1.37 10.87,1.37 11.19,1.68 11.19,2.71 10.79,3.11 9.68,3.11
BLE_LPINT  (via drill 0.36)
  Top 0.152: U3.P17 2.98,4.43 2.94,4.38 2.78,4.38 2.14,3.75 v2.14,3.59
  Top 0.203: U4.9 22.18,1.4 v21.67,0.89
  Route15 0.203: v2.14,3.59 2.67,3.06 2.67,2.58 2.78,2.48 2.78,1.37 3.41,0.73 21.51,0.73 v21.67,0.89
DCC
  Top 0.203: U4.2 19.38,1.3
  Top 0.254: 19.38,1.3 19.38,0.91 19.13,0.65 17.74,0.65 L4.2
FROMBLE_RX  (via drill 0.36)
  Top 0.152: U4.48 17.85,2.64 17.62,2.79 16.73,2.79 v16.7,2.77 | v2.06,2.4 1.43,3.03 1.43,6.21 1.75,6.53 2.36,6.53 2.96,5.93 U3.P14
  Bottom 0.203: v2.06,2.4 2.7,2.4 3.25,1.84 7.46,1.84 8.25,1.05 11.59,1.05 12.62,2.08 15.56,2.08 16.25,2.77 v16.7,2.77
  Bottom 0.254: SV1.P2 1.27,3.11 1.9,2.48 1.98,2.48 v2.06,2.4
GND  (via drill 0.36, 0.41)
  Top 0.152: 10.56,0.89 11.03,1.37 11.91,1.37
  Top 0.203: C15.2 9.08,2.6 9.52,2.16 9.52,1.52 9.76,1.29 9.76,0.81 9.84,0.89 10.56,0.89 | C19.2 16.24,6.88 16.11,7 16.11,7.32 X1.2 | U4.13 21.18,2.64 21.18,4.06 | 21.18,4.06 U4.GND | U4.33 20.08,7.84 20.08,9.22 20.15,9.29 B1.GND 20.46,9.3 20.08,9.3 20.08,9.7 C12.2 | U4.46 20.56,3.44 21.07,3.95 21.18,4.06 | 11.91,1.37 12.75,1.37 13.55,2.16 15,2.16 15.24,1.92 C11.2 15.54,1.92 | Q4.P2 15.24,14.78 15.72,14.78 15.97,14.53 R6.2 | 20.95,17.4 J2.PB.1 22.86,17.4
  Top 0.254: U3.P19 4.07,3.85 U3.G3 | U1.P6 10.56,21.14 C8.2 | U3.P23 U3.G1 | X1.2 15.77,7.5 v15,8.27 | v20,3.75 20.87,3.75 21.07,3.95 | R13.1 2.35,13.15 2.78,12.72 2.78,12.32 v3.02,12.08 | C16.1 2.57,0.92 2.38,0.73 1.27,0.73 v1.11,0.89
  Top 0.305: U1.PAD 11.99,23.51 11.75,23.75 R9.1
  Top 0.406: C1.- 7.2,22.48 7.62,22.48 7.7,22.4 7.7,22.16 8.68,21.19 C7.2
  Top 0.61: C3.2 6.14,22.46 C1.-
  Bottom 0.152: J1.P9 9.52,10.97 9.52,11.92 10,12.4 10.79,12.4
  Bottom 0.203: J2.PB.1 24.46,17.4 v24.46,18.67
  Bottom 0.406: 17.54,24.46 17.46,24.38
  other vias: 9.45,1.74 21.35,12.56 16.91,12.87 11.99,20.89 24.29,12.24 22.23,3.75 20,5.97 22.23,5.97 24.46,15.81 2.06,10.02 9.68,8.11
  pour Top (rank 6): -1.27,26.54 17.78,26.54 17.78,20.27 24.89,20.27 24.89,-0.38 -1.27,-0.38
  pour Bottom (rank 6): -1.27,26.54 17.78,26.54 17.78,20.27 24.89,20.27 24.89,-0.38 -1.27,-0.38
  pour Route2 (rank 6): -1.27,26.54 4.13,26.54 4.13,26.53 17.78,26.54 17.78,20.27 24.89,20.27 24.89,-0.38 -1.27,-0.38
  pour Route2 (no thermals): 21.11,18.91 21.11,16.05 22.7,16.05 22.7,16.13 22.7,18.91
  pour Top (no thermals): 4.76,22.96 5.24,22.48 6.19,22.48 6.19,23.51 6.03,23.67 4.76,23.67
GND3  (via drill 0.36, 0.41)
  Top 0.203: v8.48,19.94 9.28,19.94 R38.1
  Top 0.254: C27.2 13.94,18.13 v13.89,18.17 13.46,18.6 U2.P2 | R38.1 9.13,20.26 9.37,20.5 10.95,20.5 11.19,20.26 11.19,19.95 R18.1 | U7.P4 10.98,15.55 11.51,15.02 11.51,14.71 R39.1 | C38.2 11.13,15.82 U7.P4 | U7.P4 10.98,16.11 10.56,16.45 8.89,16.45 v8.73,16.61 | U6.P2 12.38,11.45 12.62,11.68 12.62,12.48 C13.2 12.81,12.51 13.26,12.95 13.26,14.08 Q4.P3 | RI2.1 0.88,20.03 v1.35,20.5
  Top 0.305: v7.75,12.9 7.75,12.35 R21.1
  Route2 0.203: 3.36,21.79 7.67,21.79
  Route2 0.254: v1.35,20.5 2.06,20.5 3.36,21.79 | 7.67,21.79 8.33,21.13 v8.48,19.94
  Bottom 0.305: v7.75,12.9 8.04,12.9 8.41,13.27
  other vias: 14.13,15.18 16.91,14.38
  pour Bottom (rank 4): 18.1,13.59 8.57,13.59 8.57,12.95 7.3,12.95 7.3,20.26 18.1,20.26
  pour Route2 (rank 4): 18.1,13.59 8.57,13.59 8.57,12.95 7.3,12.95 7.3,20.26 18.1,20.26
  pour Top (rank 4): 18.1,13.59 8.57,13.59 8.57,12.95 7.3,12.95 7.3,20.26 18.1,20.26
I_SENSE  (via drill 0.36)
  Top 0.152: U3.P5 7.27,5.97 7.62,5.97 7.88,6.23 7.88,6.71 8.1,6.92 v8.1,7.19 8.1,7.48 9.02,8.41 C2.1
  Top 0.254: C2.1 8.89,9.13 R2.2
  Bottom 0.152: SV1.P6 1.98,7.24 8.04,7.24 v8.1,7.19
METER_ENABLE  (via drill 0.36)
  Top 0.152: U3.P15 2.61,5.43 v2.34,5.65
  Top 0.203: v12.62,9.14 13.1,9.14 13.49,8.75 14.37,8.75 15.24,9.62 15.24,11.82 | Q4.P1 15.24,13.48 15.24,12 15.24,11.82 | R6.1 15.24,11.82
  Bottom 0.152: 2.38,5.65 v2.34,5.65 2.86,5.13 2.86,4.75 4.82,2.79 8.41,2.79 9.42,3.8 9.42,6.98 11.59,9.14 v12.62,9.14
N$1
  Top 0.152: 8.92,18.77 8.9,18.75 8.49,18.75 8.1,18.35 8.1,16.13 8.41,15.81 8.41,12.66 8.65,12.42 8.65,11.44 R2.1
  Top 0.203: 8.97,18.99 R37.2 8.92,18.77
  Top 0.254: U7.P7 9.68,18.28 9.21,18.75 9.21,18.91 R37.2
N$3
  Top 0.152: C34.2 8.02,0.86 X3.1 7.3,1.58 7.3,1.76 6.67,2.4 5.79,2.4 5.5,2.69 U3.P22
N$4
  Top 0.254: B1.SE 20.72,10.02 20.88,10.18 C23.1
  Top 0.267: C23.1 21.81,11.35 23.73,13.27 23.73,19.54 24.45,20.26 24.45,23.56
  Top 0.381: 24.45,23.56 Y1.P1
N$5
  Top 0.203: U4.31 20.97,7.86 B1.ANT1
N$6
  Top 0.203: U4.32 20.58,8.57 B1.ANT2
N$9
  pour Top (rank 3, no thermals): 12.7,21.37 13.73,21.37 13.97,21.13 15.32,21.13 15.32,22.24 14.21,22.24 13.57,21.61 12.7,21.61
N$10
  pour Top (rank 2, no thermals): 15.8,1.76 17.86,1.76 18.1,2 18.1,2.95 16.67,3.11 16.67,3.91 15.72,3.91 15.64,3.83 15.64,1.92
N$13
  Top 0.152: U1.P3 13.04,23.02 12.94,23.11 12.94,24.08
  Top 0.203: 12.94,24.08 12.62,24.41 10.74,24.41 10.48,24.15 10.48,23.75
  Top 0.254: R7.1 9.68,23.75 | 9.68,23.75 C4.2 | 9.68,23.75 10.48,23.75 R9.2
N$16
  Top 0.152: 17.62,8.19 16.43,8.19 16.19,8.43 16.19,8.64 X1.1
  Top 0.203: U4.37 18.06,7.04 17.86,7.24 17.86,8.12 C18.1 17.67,8.15 17.62,8.19
N$17
  Top 0.203: U4.38 17.12,6.64 | 17.12,6.64 C19.1 | X1.3 17.04,6.73 17.12,6.64
N$18
  Top 0.203: U4.39 17.66,6.24 17.38,5.97 17.15,5.97 C20.1
N$19
  Top 0.203: U4.29 21.78,8.73 C21.1
N$23
  Top 0.152: U3.P18 2.7,3.27 2.7,2.48 3.09,2.09 C16.2
  pour Top (rank 2, no thermals): 3.81,4.06 3.02,4.06 2.7,3.75 2.7,1.68 3.49,1.68 3.49,2.32 3.81,2.64
N$37
  Top 0.203: R15.2 17.36,16.59 17.36,19.09 16.83,19.62 16.51,19.62 16.5,19.61 L3.2
  Top 0.254: L3.2 16.02,20.01 R14.1 15.01,19.94 | R15.2 17.14,15.5 17.14,15.49 17.14,15.47 R16.2
N$38
  Top 0.254: L3.1 16.19,17.8 R14.2 15.01,18.98 U2.P1
N$40
  Top 0.254: R20.1 10,12.77 U6.P1 9.27,12.1 R21.2
N$41
  Top 0.152: RI1.2 1.74,17.01 2.51,16.23 2.51,13.98 3.54,12.95 5.95,12.95 8.25,10.65 9.45,10.65 9.59,10.8 U6.P3
  Top 0.254: U6.P3 10.65,10.8 10.85,10.6 RF.1 | RI2.2 RI1.2
N$56
  Top 0.203: 4.84,2.08 4.84,1.98 C6.2 | C6.2 5.22,1.96 X3.2 | U3.P21 5,2.14 C6.2
N$65
  Top 0.254: R18.2 12.7,19.94 12.81,19.83 U2.P3 12.81,18.08 13.41,17.48 13.41,16.76 R17.1
N$66
  Top 0.254: U7.P6 10.33,18.89 R37.1 10.23,19.76 R38.2
N$68
  Top 0.254: R35.1 9.49,14.82 | 9.49,14.82 9.03,15.28 U7.P1 | U7.P2 9.68,15.01 9.49,14.82
N$70
  Top 0.254: U7.P3 10.33,14.78 R39.2 10.48,14.77 | R40.1 10.4,14.47 10.48,14.54 10.48,14.77 | 10.48,14.86 10.48,14.77
PWM_CURRENT  (via drill 0.36)
  Top 0.152: U3.P3 8.3,4.93 v8.35,4.98
  Bottom 0.152: SV1.P5 7.46,6.92 7.8,6.58 8.68,6.58 9.05,6.21 9.05,5.68 v8.35,4.98
PWM_VOLTAGE  (via drill 0.36)
  Top 0.152: U3.P4 7.91,5.43 v8.44,5.95
  Bottom 0.152: SV1.P4 1.27,5.65 1.27,6.05 1.83,6.6 7.19,6.6 7.84,5.95 v8.44,5.95
RST  (via drill 0.36)
  Top 0.152: 3.65,7.56 3.65,9.52 v4.13,10 | 3.65,7.56 3.65,7.55 3.64,7.56 3.17,7.56 3.02,7.4 R19.1 | U3.P12 3.65,7.5 3.65,7.56
  Bottom 0.152: J1.P10 7.31,10.34 6.83,9.86 5.48,9.86 5.16,10.18 4.3,10.18 v4.13,10
SWDCLK  (via drill 0.36)
  Top 0.152: R4.1 24.25,9.74 23.49,10.49 v23.49,11.05
  Top 0.203: U4.24 24.18,8.69 R4.1
  Bottom 0.152: J4.4 16.64,11.65 17.36,12.37 20.03,12.37 20.56,11.84 22.7,11.84 v23.49,11.05
SWDIO/!RESET  (via drill 0.36)
  Top 0.152: U4.23 24.72,6.64 24.82,6.76 24.82,9.09 24.61,9.3 24.61,10.26 v24.45,10.41
  Bottom 0.152: J4.2 18.14,11.65 18.57,12.07 19.53,12.07 20,11.61 20.24,11.37 22.23,11.37 23.34,10.26 24.29,10.26 v24.45,10.41
TCK  (via drill 0.36)
  Top 0.152: U3.P10 5,8.35 4.96,8.4 v4.84,8.51
  Bottom 0.152: J1.P7 11.43,10.18 10.32,9.07 7.46,9.07 7.22,8.83 6.83,8.83 6.19,8.19 5.32,8.19 5,8.51 v4.84,8.51
TDI  (via drill 0.36)
  Top 0.152: U3.P8 6,8.79 v6.06,8.93
  Bottom 0.152: J1.P3 10.79,10.97 10.79,10.02 10.16,9.38 7.3,9.38 7.06,9.14 6.36,9.14 v6.06,8.93
TDO  (via drill 0.36, 0.41)
  Top 0.152: U3.P7 6.5,7.55 v6.9,8.03 | R13.2 2.14,13.98 2.14,13.91 3.41,12.64 4.29,12.64 5,11.92 v5,11.84
  Top 0.254: R13.2 1.93,14.3 R22.1
  Bottom 0.152: J1.P1 7.46,11.61 6.91,12.16 5.32,12.16 v5,11.84 3.17,10.02 3.17,8.83 4.13,7.87 6.83,7.87 v6.9,8.03
TEMP
  Top 0.203: 1.27,17.4 1.27,16.76
  pour Route15: 4.76,21.13 2.78,21.13 2.38,20.73 2.38,14.22 3.02,13.59 4.6,13.59 5.08,13.11 7.46,13.11 8.02,13.67 8.02,21.21 7.54,21.69 5.32,21.69
  pour Route15: 21.27,13.67 22.62,13.67 23.02,14.07 23.02,20.57 22.38,21.21 21.43,21.21 20.32,22.32 17.94,22.32 17.38,21.76 17.38,12.95 17.86,12.48 20.08,12.48
  pour Bottom: 4.76,21.13 2.78,21.13 2.38,20.73 2.38,14.22 3.02,13.59 4.6,13.59 5.08,13.11 7.46,13.11 8.02,13.67 8.02,21.21 7.54,21.69 5.32,21.69
  pour Top: 4.76,21.13 2.78,21.13 2.38,20.73 2.38,14.22 3.02,13.59 4.6,13.59 5.08,13.11 7.46,13.11 8.02,13.67 8.02,21.21 7.54,21.69 5.32,21.69
  pour Route2: 4.76,21.13 2.78,21.13 2.38,20.73 2.38,14.22 3.02,13.59 4.6,13.59 5.08,13.11 7.46,13.11 8.02,13.67 8.02,21.21 7.54,21.69 5.32,21.69
  pour Top: 20.64,14.3 21.99,14.3 22.38,14.7 22.38,20.57 21.75,21.21 20.8,21.21 20.32,21.69 18.57,21.69 18.02,21.13 18.02,14.22 18.49,13.75 20.08,13.75
  pour Bottom: 20.64,14.3 21.99,14.3 22.38,14.7 22.38,20.57 21.75,21.21 20.8,21.21 20.32,21.69 18.57,21.69 18.02,21.13 18.02,14.22 18.49,13.75 20.08,13.75
TEST  (via drill 0.36)
  Top 0.152: U3.P11 4.5,7.58 4.21,7.87 4.21,8.78 v4.91,9.5
  Bottom 0.152: J1.P8 10.16,9.94 9.92,9.7 7.14,9.7 6.98,9.54 5.05,9.54 v4.91,9.5
TMS  (via drill 0.36)
  Top 0.152: U3.P9 5.5,8.08 5.45,8.14 5.45,9.2 5.79,9.54 6.64,9.54 v7.73,8.45
  Bottom 0.152: J1.P5 12.62,11.61 12.06,11.05 12.06,9.78 11.75,9.46 11.19,9.46 10.48,8.75 9.13,8.75 8.83,8.45 v7.73,8.45
TOBLE_TX  (via drill 0.36)
  Top 0.152: v2.06,1.45 1.43,2.08 1.43,2.48 1.03,2.87 1.03,6.37 1.59,6.92 2.46,6.92 2.96,6.43 U3.P13 | U4.47 17.85,3.04 17.22,3.51
  Top 0.203: U3.P13 3.41,6.44 | 17.22,3.51 v17.25,3.51
  Bottom 0.203: v2.06,1.45 7.14,1.45 7.94,0.65 16.75,0.65 18.1,2 18.1,2.64 17.25,3.49 v17.25,3.51
  Bottom 0.254: SV1.P1 1.67,1.84 v2.06,1.45
V+  (via drill 0.36)
  Top 0.203: U4.12 23.38,0.98 C24.1 v22.58,0.89 | U4.1 18.98,1.46 18.81,1.29 18.44,1.29 v18.36,1.37
  Top 0.254: v18.36,1.37 16.83,1.37 16.28,0.82 C11.1 15.11,0.82 Q1.P3
  Bottom 0.254: v18.36,1.37 20.8,1.37 21.63,2.2
  Bottom 0.305: J4.1 18.66,9.46 19.05,9.46 21.19,7.32 21.19,2.64 21.63,2.2 22.58,1.25 v22.58,0.89
V_SENSE  (via drill 0.36)
  Top 0.152: RF.2 11.85,9.64 11.03,8.83 9.76,7.08 9.42,6.05 9.42,4.06 9.01,3.71 v8.31,3.71 8.09,3.93 U3.P1
  Top 0.254: RF.2 11.9,10.15 U6.P4
  Bottom 0.152: 1.27,4.38 1.35,4.46 1.35,4.86 1.72,5.23 1.72,6.02 1.97,6.27 2.79,6.27 3.17,5.89 3.17,4.91 4.95,3.11 7.7,3.11 v8.31,3.71
  Bottom 0.203: SV1.P3 1.27,4.38
VAMP
  Top 0.254: C39.1 12.02,17.72 12.38,17.72 12.81,17.29 U2.P4 12.86,17.03 R17.2
VCC  (via drill 0.41)
  Top 0.152: D2.C 4.68,24.38 4.29,23.99 4.29,22.89 v4.72,22.45
  Top 0.254: R11.2 0.95,12.44 v0.95,13.27
  Bottom 0.152: SV1.P10 1.59,13.27 2.14,13.83 2.14,19.3 2.38,19.54 2.38,20.73 3.41,21.77 4.1,21.77 4.72,22.38 v4.72,22.45
  Bottom 0.203: 1.27,13.27 SV1.P10
  Bottom 0.254: SV1.P10 v0.95,13.27
  pour Top (rank 2, no thermals): 11.19,22.08 10.48,22.08 10.4,22 8.65,22 7.06,23.59 6.59,23.59 6.19,23.99 4.68,23.99 4.68,24.78 7.46,24.78 8.02,24.23 8.02,23.43 8.49,22.96 11.19,22.96
VCC_SENSE
  Top 0.152: R12.2 4.21,11.45 5.79,9.86 7.23,9.86 8.34,8.75 8.34,8.18 7.96,7.8 7.62,7.8 7.23,7.4 U3.P6
  Top 0.254: R12.2 R11.1
VDD_PA
  Top 0.152: U4.30 21.38,8.32 21.31,8.39 21.31,9.27 21.43,9.38 21.73,9.38 C22.1
  Top 0.203: B1.VCC 21.29,9.29 21.31,9.27
VFILT  (via drill 0.36)
  Top 0.152: 9.09,12.88 v9.07,12.9 | v9.02,7.45 9.07,7.42 9.07,4.65 8.76,4.33 7.99,4.33 7.89,4.43 U3.P2
  Top 0.203: R35.2 9.6,13.43 v9.07,12.9
  Top 0.254: U7.P5 10.98,18.75 v11.07,18.85 11.13,18.79 C39.2
  Route15 0.254: v9.02,7.45 8.97,7.5 8.97,8.51 9.07,8.61 v9.07,12.9
  Bottom 0.152: v9.07,12.9 8.44,12.27 7.43,12.27 7.14,12.56 4.52,12.56 3.33,11.37 2.22,11.37 1.59,12 SV1.P9
  Bottom 0.203: v9.07,12.9 10.08,13.91 12.7,13.91 13.02,14.22 13.02,16.13 11.07,18.07 v11.07,18.85
VS+  (via drill 0.36)
  Top 0.203: C9.1 13.49,24.39 13.41,24.46 | 13.41,24.46 13.1,24.78 8.89,24.78 8.49,24.38 8.49,24.07 | 13.41,24.46 v13.41,24.51
  Top 0.254: C4.1 8.57,23.2 8.57,23.75 8.49,23.83 8.49,24.07 R7.2
  Bottom 0.203: v13.41,24.51 13.14,24.78 1.43,24.78 0.63,23.99 0.63,15.89 1.03,15.73 SV1.P12
  pour Top (rank 2, no thermals): 12.7,22 14.6,22 15.32,22.72 16.03,22.72 16.03,24.78 14.13,24.78 13.26,23.91 13.26,22.8 12.7,22.24
VTEST
  Top 0.152: 5.08,17.4 J2.PA.3
  Top 0.254: RI1.1 2.38,19.57 2.43,19.62
  Top 0.305: 2.43,21.2 2.43,19.62 2.43,17.74 2.78,17.4
  Top 0.406: R3.1 2.43,21.2 | 2.78,17.4 5.08,17.4
  Top 0.61: 2.43,21.21 2.43,21.2
ZC  (via drill 0.41)
  Top 0.254: R22.2 0.95,15.46 v0.95,14.54 | D1.C 3.64,22.57 v3.76,22.45
  Bottom 0.152: SV1.P11 1.59,14.54 1.75,14.7 1.75,19.46 2.06,19.78 2.06,21.84 2.67,22.45 v3.76,22.45
  Bottom 0.254: SV1.P11 v0.95,14.54
  pour Top (no thermals): 3.89,22.96 0.71,22.96 0.56,23.11 0.56,24.86 3.89,24.86

### Text on the board
tPlace: PowerBlade 3v4 | S.DeBruin 2.23.16
bPlace: PowerBlade | S.DeBruin